# Altium schematic sheet Sheet2.SchDoc
size A4
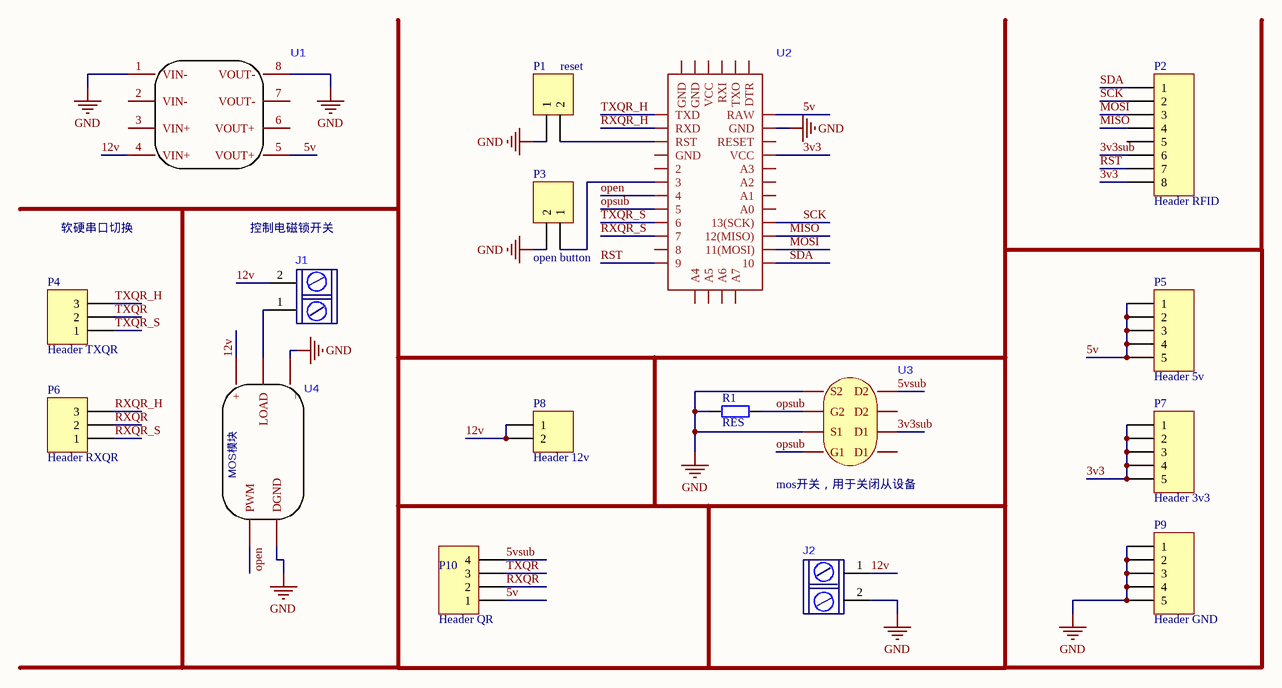
[diagram p0: Sheet2.SchDoc]

## Parts
J1  (no value)  [KF301-5.0-2P]
J2  (no value)  [KF301-5.0-2P]
P1  reset  [HDR1X2]
P2  Header RFID  [HDR1X8]
P3  open button  [HDR1X2]
P4  Header TXQR  [HDR1X3]
P5  Header 5v  [HDR1X5]
P6  Header RXQR  [HDR1X3]
P7  Header 3v3  [HDR1X5]
P8  Header 12v  [HDR1X2]
P9  Header GND  [HDR1X5]
P10  Header QR  [HDR1X4]
R1  RES  [0603]
U1  (no value)  [MP1584EN_3A]
U2  (no value)  [ARDUINO-LGT8F-328D_AS_PRO_MINI-PRO-2]
U3  (no value)  [IC-MOS-9926A-SOP8]
U4  (no value)  [PCBComponent_1 - duplicate]

## Nets
GND: J2.2 P1.1 P3.2 P9.1 P9.2 P9.3 P9.4 P9.5 R1.1 U1.1(VIN-) U1.8(VOUT-) U2.23(GND) U3.S1 U3.S2 U4.2(DGND) U4.5(_)
3v3: P2.8 P7.1 P7.2 P7.3 P7.4 P7.5 U2.21(VCC)
3v3sub: P2.6 U3.D1
5v: P5.1 P5.2 P5.3 P5.4 P5.5 P10.1 U1.5(VOUT+) U2.24(RAW)
5vsub: P10.4 U3.D2
12v: J1.2 J2.1 P8.1 P8.2 U1.4(VIN+) U4.3(+)
MISO: P2.4 U2.15(12(MISO))
MOSI: P2.3 U2.14(11(MOSI))
open: U2.7(4) U4.1(PWM)
opsub: R1.2 U2.8(5) U3.G1 U3.G2
RST: P2.7 U2.12(9)
RXQR: P6.2 P10.2
RXQR_H: P6.3 U2.2(RXD)
RXQR_S: P6.1 U2.10(7)
SCK: P2.2 U2.16(13(SCK))
SDA: P2.1 U2.13(10)
TXQR: P4.2 P10.3
TXQR_H: P4.3 U2.1(TXD)
TXQR_S: P4.1 U2.9(6)
NetJ1_1: J1.1 U4.4(LOAD)
NetP1_2: P1.2 U2.3(RST)
NetP3_1: P3.1 U2.6(3)

Not connected (* = marked no-connect by the designer): P2 5; U1 2(VIN-) 3(VIN+) 6(VOUT+) 7(VOUT-); U2 4(GND) 5(2) 11(8) 17(A0) 18(A1) 19(A2) 20(A3) 22(RESET) 25(DTR) 26(TXO) 27(RXI) 28(VCC) 29(GND) 30(GND) 31(A4) 32(A5) 33(A6) 34(A7)

## Notes on the sheet
- 软硬串口切换
- 控制电磁锁开关
- (near U3) mos开关，用于关闭从设备
- (in symbol 光耦隔离MOSFET模块) MOS模块

## Library data of the parts
J1 J2 = KF301
P1 P3 P8 = Header 2: Header, 2-Pin; LatestRevisionDate: 17-Jul-2002; LatestRevisionNote: Re-released for DXP Platform.; Publisher: Altium Limited
P2 = Header 8: Header, 8-Pin; LatestRevisionDate: 17-Jul-2002; LatestRevisionNote: Re-released for DXP Platform.; Publisher: Altium Limited
P4 P6 = Header 3: Header, 3-Pin; LatestRevisionDate: 17-Jul-2002; LatestRevisionNote: Re-released for DXP Platform.; Publisher: Altium Limited
P5 P7 P9 = Header 5: Header, 5-Pin; LatestRevisionDate: 17-Jul-2002; LatestRevisionNote: Re-released for DXP Platform.; Publisher: Altium Limited
P10 = Header 4: Header, 4-Pin; LatestRevisionDate: 17-Jul-2002; LatestRevisionNote: Re-released for DXP Platform.; Publisher: Altium Limited
R1 = RES: Resistor
U1 = MP1584EN_3A
U2 = ARDUINO-PRO-MINI
U3 = IC-9926A
U4 = 光耦隔离MOSFET模块